# EAGLE design p-mos breakout (EAGLE 6.5.0)
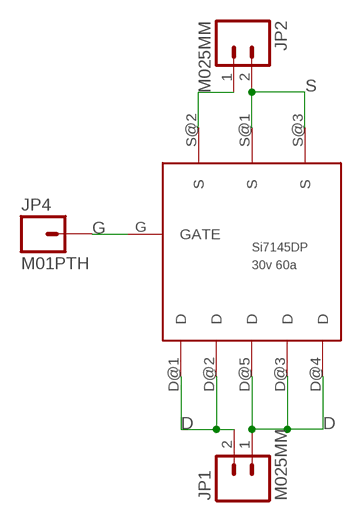
[diagram p0: schematic, sheet 1]

## Parts
JP1  M025MM  [SCREWTERMINAL-5MM-2]
JP2  M025MM  [SCREWTERMINAL-5MM-2]
JP4  M01PTH  [1X01]
U$1  PMOS-SI7145DP  [S0-8]

## Nets
D: JP1.1 JP1.2 U$1.D@1(D) U$1.D@2(D) U$1.D@3(D) U$1.D@4(D) U$1.D@5(D)
G: JP4.1 U$1.G(GATE)
S: JP2.1 JP2.2 U$1.S@1(S) U$1.S@2(S) U$1.S@3(S)

## Library data of the parts
JP1 JP2 = SparkFun-Connectors:M02: Standard 2-pin 0.1" header. Use with - straight break away headers ( PRT-00116) - right angle break away headers (PRT-00553) - swiss pins (PRT-00743) - machine pins (PRT-00117) - female headers (PRT-00115) Molex polarized connector foot print use with: PRT-08233 with associated crimp pins and housings. 2.54_SCREWTERM for use with PRT-10571. 3.5mm Screw Terminal footprints for PRT-08084 5mm Screw Terminal footprints for use with PRT-08433
JP4 = SparkFun-Connectors:M01: Header 1 Standard 1-pin 0.1" header. Use with straight break away headers (SKU : PRT-00116), right angle break away headers (PRT-00553), swiss pins (PRT-00743), machine pins (PRT-00117), and female headers (PRT-00115).
U$1 = Richards:PMOS-SI7145DP

## Board
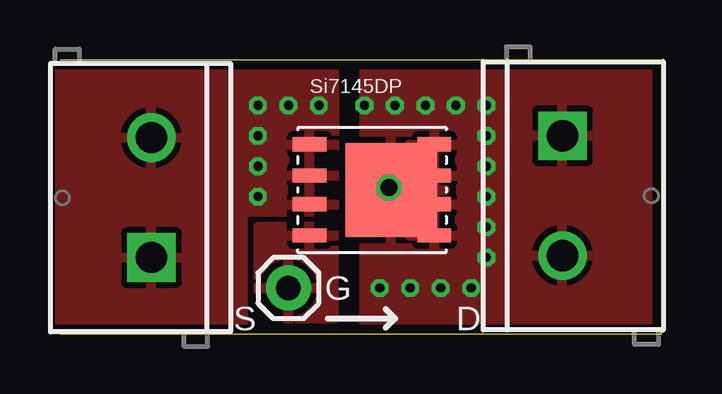
[diagram p1: board, top side]
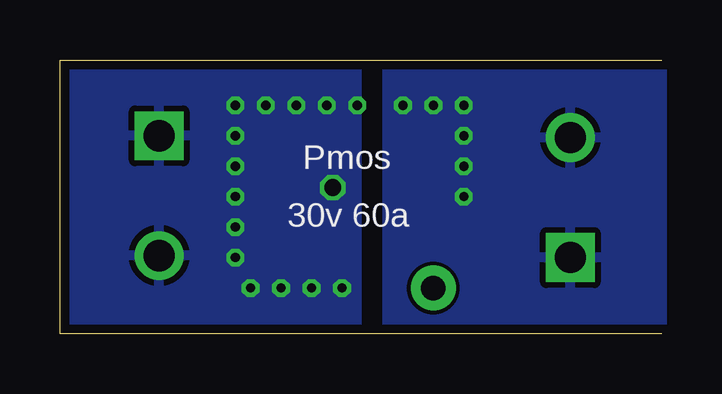
[diagram p2: board, bottom side, seen from below]

Size 25.09 x 11.42 mm. Coordinates in mm from the lower left corner, seen from the top.
Outline: 0,0 25.09,0 25.09,11.42 0,11.42
Copper layers (1*16): Top 0.0356mm / dielectric 1.5011mm / Bottom 0.0356mm
Design rules "LaenPCBOrder": minimum track width 6mil, minimum drill 13mil, track to track 6mil, track to pad 6mil, pad to pad 6mil, via to via 6mil, smd to smd 6mil, copper to edge 15mil, drill to drill 6mil, minimum pad ring 7mil, minimum via ring 7mil, stop-mask expansion 3mil, vias tented up to drill 0mil, thermal gap 10mil

### Footprints (pad centres in the part's own frame; a part is rotated, then mirrored left to right if it is on the bottom)
SCREWTERMINAL-5MM-2 = drill 1.3 pad 2.032 square: 1 0,0 | drill 1.3 pad 2.032: 2 5,0
1X01 = drill 1.016 pad 1.88: 1 0,0
S0-8 = smd 3.81 x 3.91: D@1 0.6,-0.1 | smd 1.4 x 0.6: D@2 2.4,1.8; D@3 2.4,0.5; D@4 2.4,-0.7; D@5 2.4,-2; G -2.8,-2; S@1 -2.8,0.5; S@2 -2.8,-0.7; S@3 -2.8,1.8

### Placement (x,y rotation side)
JP1  20.95,8.26 270 top
JP2  3.81,3.17 90 top
JP4  9.53,1.91 0 top
U$1  13.21,6.1 0 top

### Tracks (layer width: path | path; a pad name or v marks a point on that pad's centre or on a via)
D  (via drill 0.38, 0.7)
  other vias: 13.34,1.91 14.61,1.91 15.88,1.91 17.14,1.91 17.78,3.17 17.78,4.45 17.78,5.71 17.78,6.99 17.78,8.26 17.78,9.53 16.51,9.53 15.24,9.53 13.97,9.53 12.7,9.53 13.72,6.1
  pour Top: 12.7,0 12.7,11.43 24.77,11.43 24.77,0
  pour Bottom: 12.7,0 12.7,11.43 24.77,11.43 24.77,0
G
  pour Top: 11.43,4.45 8.26,4.45 8.26,0.64 11.43,0.64
S  (via drill 0.38)
  other vias: 10.79,9.53 9.53,9.53 8.26,8.26 8.26,6.99 8.26,5.71 8.26,9.53
  pour Bottom: 11.43,0 11.43,11.43 0,11.43 0,0
  pour Top: 11.43,11.43 11.43,5.08 7.62,5.08 7.62,0 0,0 0,11.43

### Text on the board
tPlace: Si7145DP | G | S | D
bPlace: Pmos | 30v 60a